# EAGLE design LINX DMX RECIEVER (EAGLE 7.7.0)
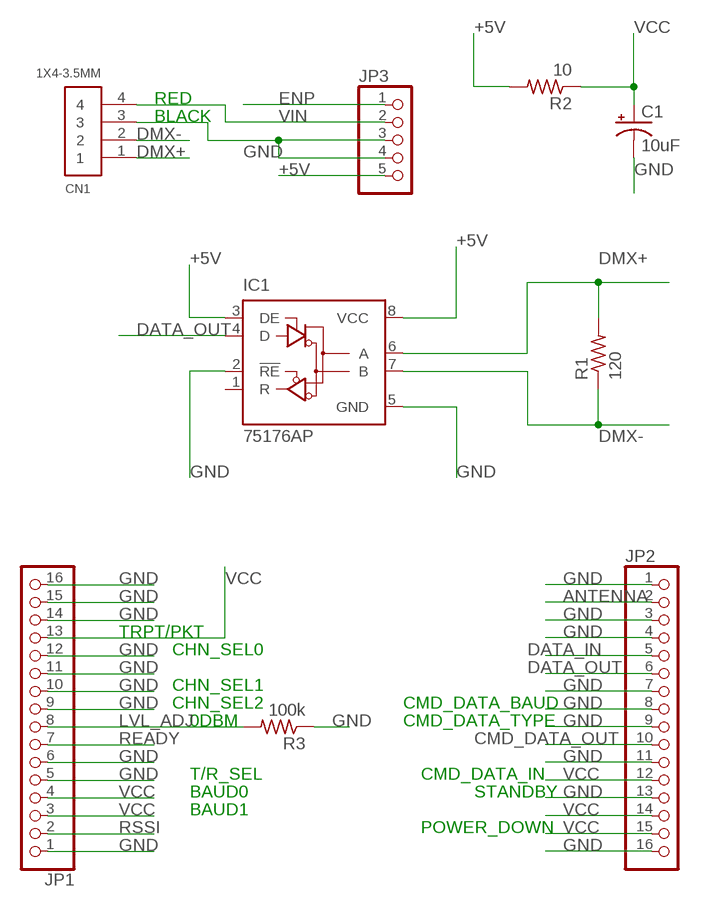
[diagram p0: schematic, sheet 1]

## Parts
C1  10uF  CPOL-USB45181A  [B45181A]
CN1  1X4-3.5MM  [1X04-3.5MM]
IC1  75176AP  [DIL08]
JP1  PINHD-1X16  [1X16]
JP2  PINHD-1X16  [1X16]
JP3  PINHD-1X5/90  [1X05/90]
R1  120  R-US_0414/15  [0414/15]
R2  10  R-US_0414/15  [0414/15]
R3  100k  R-US_0414/15  [0414/15]

## Nets
+5V: IC1.3(DE) IC1.8(VCC) JP3.5 R2.2
ANTENNA: JP2.2
CMD_DATA_OUT: JP2.10
DATA_IN: JP2.5
DATA_OUT: IC1.4(D) JP2.6
DMX+: CN1.1 IC1.6(A) R1.2
DMX-: CN1.2 IC1.7(B) R1.1
ENP: JP3.1
GND: C1.- CN1.3 IC1.2(!RE) IC1.5(GND) JP1.1 JP1.5 JP1.6 JP1.9 JP1.10 JP1.11 JP1.12 JP1.14 JP1.15 JP1.16 JP2.1 JP2.3 JP2.4 JP2.7 JP2.8 JP2.9 JP2.11 JP2.13 JP2.16 JP3.3 JP3.4 R3.1
LVL_ADJ: JP1.8 R3.2
READY: JP1.7
RSSI: JP1.2
VCC: C1.+ JP1.3 JP1.4 JP1.13 JP2.12 JP2.14 JP2.15 R2.1
VIN: CN1.4 JP3.2
Unconnected: IC1.1(R)

## Notes on the sheet
- RED
- BLACK
- TRPT/PKT
- CHN_SEL0
- CHN_SEL1
- CHN_SEL2 | CMD_DATA_BAUD
- 0DBM | CMD_DATA_TYPE
- T/R_SEL | CMD_DATA_IN
- BAUD0 | STANDBY
- BAUD1
- POWER_DOWN

## Library data of the parts
C1 = rcl:CPOL-US: POLARIZED CAPACITOR, American symbol
CN1 = adafruit:1X4: 4-pin connector
IC1 = 751xx:75176A: DIFFERENTIAL BUS TRANSCEIVER Source: http://focus.ti.com/lit/ds/symlink/sn75176a.pdf
JP1 JP2 = pinhead:PINHD-1X16: PIN HEADER
JP3 = pinhead:PINHD-1X5: PIN HEADER
R1-R3 = rcl:R-US_: RESISTOR, American symbol

## Board
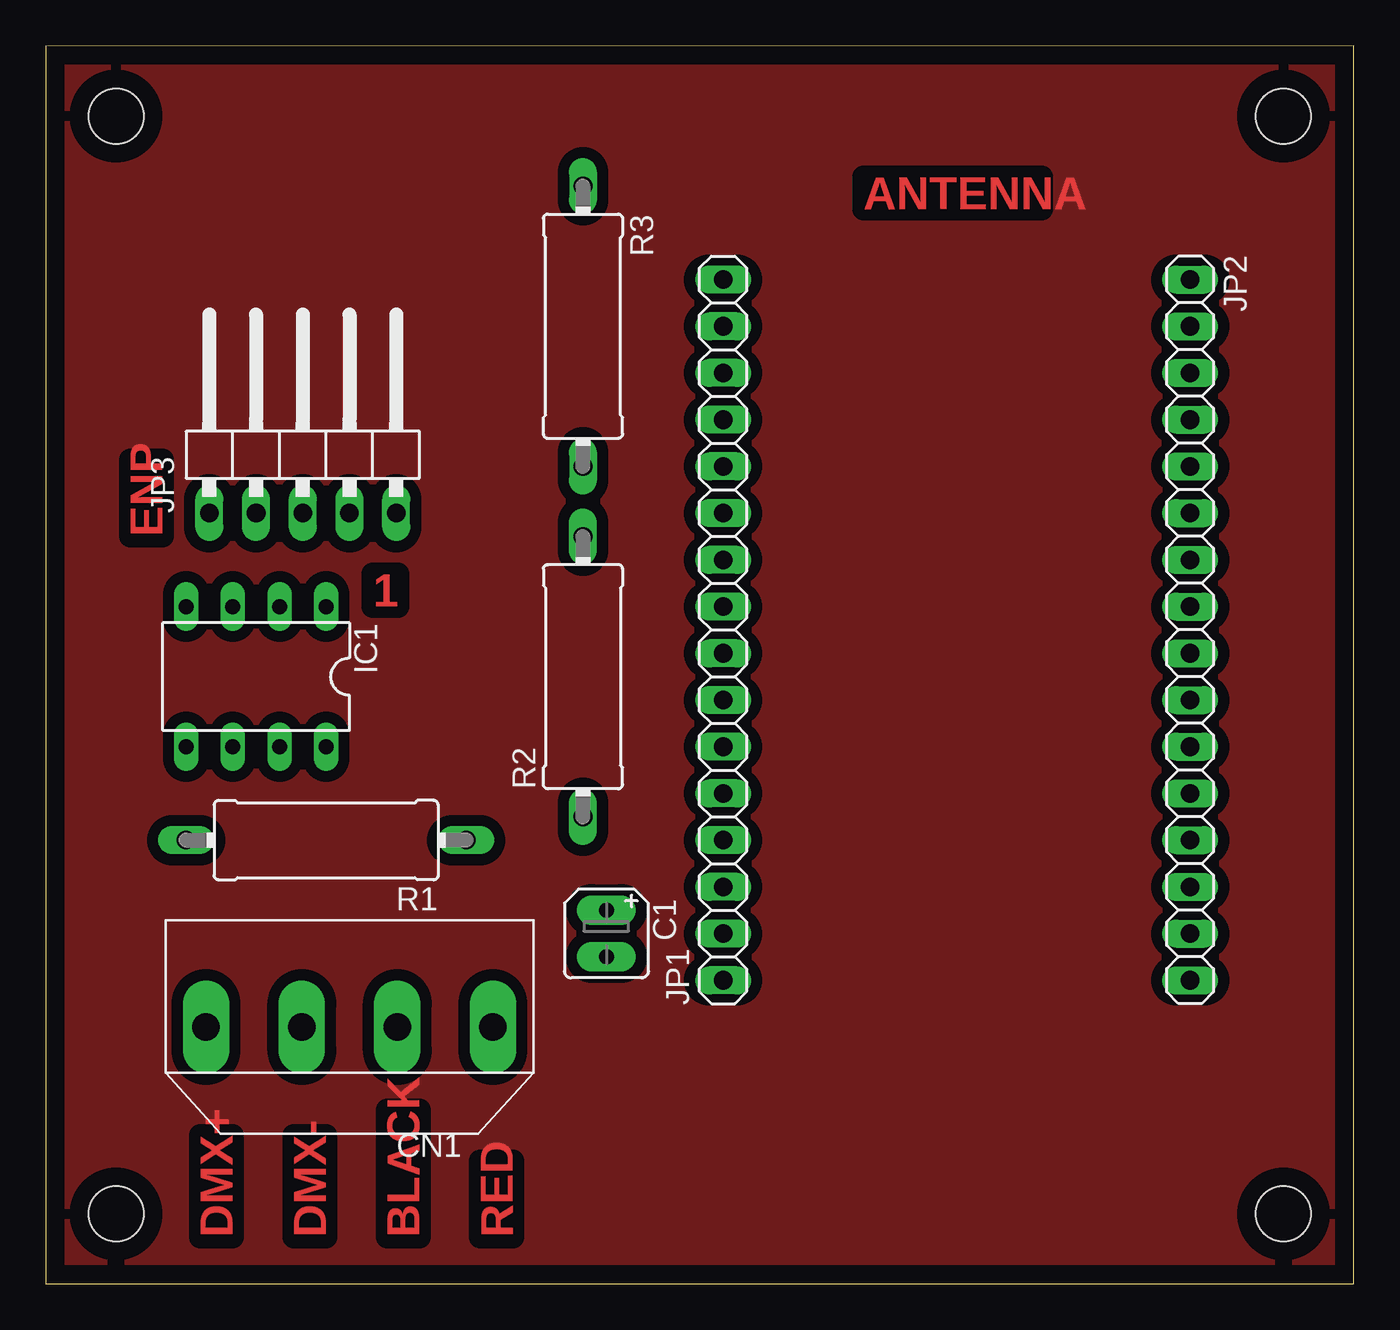
[diagram p1: board, top side]
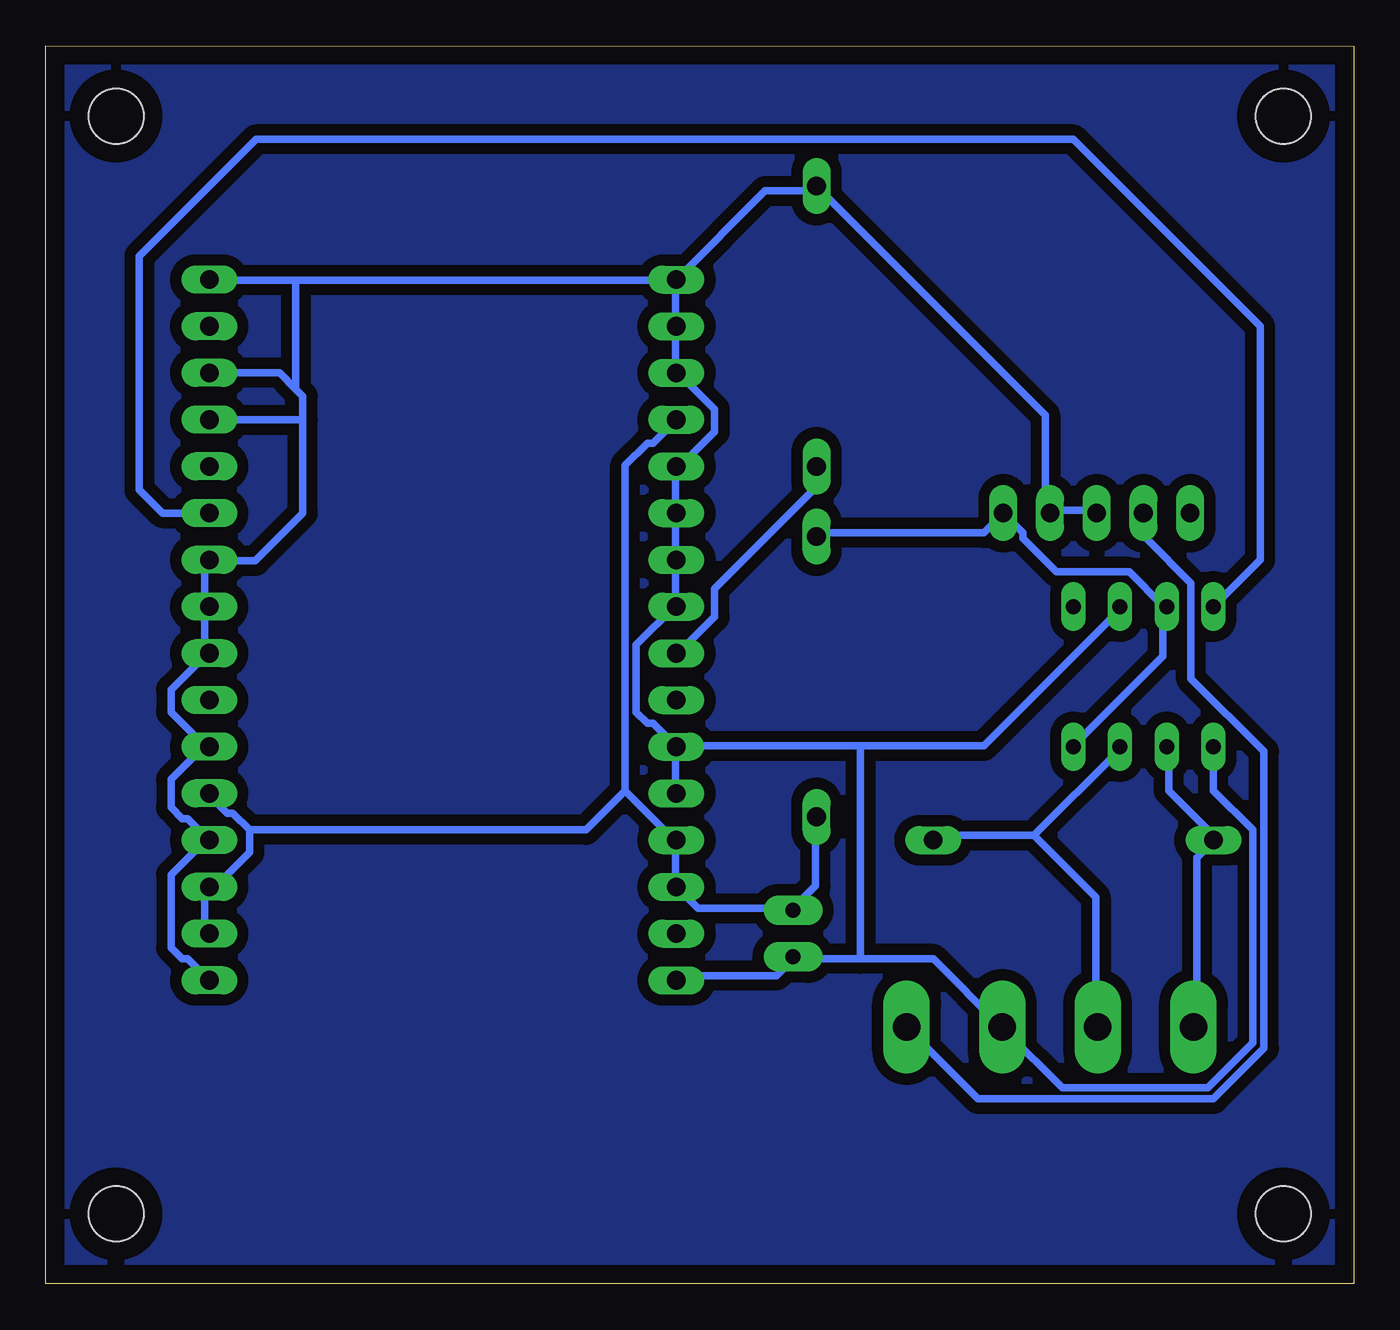
[diagram p2: board, bottom side, seen from below]

Size 71.12 x 67.31 mm. Coordinates in mm from the lower left corner, seen from the top.
Outline: 0,0 71.12,0 71.12,67.31 0,67.3 0,0
Copper layers (1*16): Top 0.035mm / dielectric 1.5mm / Bottom 0.035mm
Design rules "default *": minimum track width 16mil, minimum drill 24mil, track to track 8mil, track to pad 12mil, pad to pad 8mil, via to via 8mil, smd to smd 8mil, copper to edge 40mil, drill to drill 8mil, minimum pad ring 10mil, minimum via ring 8mil, stop-mask expansion 4mil, vias tented up to drill 0mil, thermal gap 10mil
Holes 3 mm at 3.81,3.81 67.31,3.81 67.31,63.5 3.81,63.5

### Footprints (pad centres in the part's own frame; a part is rotated, then mirrored left to right if it is on the bottom)
B45181A = drill 0.813 pad 1.6 long: + -1.27,0; - 1.27,0
1X04-3.5MM = drill 1.5 pad 2.54 long: 1 -7.8,0; 2 -2.6,0; 3 2.6,0; 4 7.8,0
DIL08 = drill 0.813 long: 1 -3.81,-3.81; 2 -1.27,-3.81; 3 1.27,-3.81; 4 3.81,-3.81; 5 3.81,3.81; 6 1.27,3.81; 7 -1.27,3.81; 8 -3.81,3.81
1X16 = drill 1.016 long: 1 -19.05,0; 2 -16.51,0; 3 -13.97,0; 4 -11.43,0; 5 -8.89,0; 6 -6.35,0; 7 -3.81,0; 8 -1.27,0; 9 1.27,0; 10 3.81,0; 11 6.35,0; 12 8.89,0; 13 11.43,0; 14 13.97,0; 15 16.51,0; 16 19.05,0
1X05/90 = drill 1.016 long: 1 -5.08,-3.81; 2 -2.54,-3.81; 3 0,-3.81; 4 2.54,-3.81; 5 5.08,-3.81
0414/15 = drill 1.016 long: 1 -7.62,0; 2 7.62,0

### Placement (x,y rotation side)
C1  30.48,19.05 270 top
CN1  16.51,13.97 0 top
IC1  11.43,33.02 180 top
JP1  36.83,35.56 90 top
JP2  62.23,35.56 270 top
JP3  13.97,45.72 0 top
R1  15.24,24.13 180 top
R2  29.21,33.02 90 top
R3  29.21,52.07 270 top

### Tracks (layer width: path | path; a pad name or v marks a point on that pad's centre or on a via)
+5V
  Bottom 0.406: R2.2 28.96,40.84 20.12,40.84 JP3.5 17.98,40.84 17.98,40.54 16.15,38.71 12.19,38.71 10.36,36.88 IC1.3 10.36,36.58 10.36,34.14 15.24,29.26 IC1.8
DATA_OUT
  Bottom 0.406: IC1.4 5.08,39.37 5.08,52.07 15.24,62.23 59.69,62.23 66.04,55.88 66.04,43.18 64.77,41.91 JP2.6
DMX+
  Bottom 0.406: IC1.6 10.06,28.96 10.06,26.82 7.62,24.38 R1.2 7.62,24.08 8.53,23.16 8.53,14.02 CN1.1
DMX-
  Bottom 0.406: 17.37,24.38 12.8,28.96 IC1.7 | 17.37,24.38 22.86,24.38 R1.1 | 17.37,24.38 14.02,21.03 14.02,14.02 CN1.2
GND
  Bottom 0.406: 30.48,17.68 31.39,16.76 36.58,16.76 JP1.1 | IC1.5 7.62,26.82 5.49,24.69 5.49,13.11 7.92,10.67 15.85,10.67 18.9,13.72 CN1.3 19.2,14.02 22.86,17.68 26.82,17.68 | 26.82,17.68 30.48,17.68 | 30.48,17.68 C1.- | 62.48,54.56 JP2.1 62.18,54.56 57.53,54.56 | JP2.16 63.4,17.68 63.7,17.68 64.31,18.29 64.31,22.25 62.48,24.08 JP2.13 63.4,25.3 63.7,25.3 64.31,25.91 64.31,27.43 62.48,29.26 | 62.48,29.26 64.31,31.09 64.31,32.31 62.48,34.14 JP2.9 62.48,34.44 62.48,36.58 JP2.8 62.48,36.88 62.48,39.32 | 62.48,29.26 JP2.11 | 62.48,39.32 JP2.7 | 26.82,29.26 36.58,29.26 JP1.6 | 26.82,29.26 20.12,29.26 12.8,36.58 IC1.2 | JP1.5 36.88,26.82 36.88,28.96 JP1.6 | 36.88,36.88 36.88,39.32 JP1.10 36.88,39.62 36.88,41.76 JP1.11 36.88,42.06 36.88,44.2 JP1.12 36.58,44.5 34.75,46.33 34.75,47.55 36.58,49.38 JP1.14 36.88,49.68 36.88,51.82 JP1.15 36.88,52.12 36.88,54.56 | JP3.3 14.02,42.06 16.46,42.06 JP3.4 16.76,42.06 16.76,47.24 R3.1 29.26,59.44 32,59.44 JP1.16 36.88,54.56 | JP1.6 38.1,30.48 38.41,30.48 39.01,31.09 39.01,34.75 36.88,36.88 | 36.88,36.88 JP1.9 | 36.88,54.56 57.53,54.56 | 26.82,29.26 26.82,17.68 | 62.48,39.32 59.74,39.32 57.15,41.91 57.15,46.99 | 57.15,46.99 57.15,48.26 57.53,48.64 | 57.53,48.64 58.42,49.53 JP2.3 | JP2.4 57.15,46.99 | 57.53,54.56 57.53,48.64
LVL_ADJ
  Bottom 0.406: R3.2 29.26,44.2 29.26,43.28 34.75,37.8 34.75,36.27 36.58,34.44 JP1.8
N$1
  pour Top (isolate 0.61): 0,67.31 71.12,67.31 71.12,0 0,0
N$2
  pour Bottom (isolate 0.61): 0,67.31 71.12,67.31 71.12,0 0,0
VCC
  Bottom 0.406: JP2.15 62.48,19.2 62.48,21.34 JP2.14 62.18,21.34 60.05,23.47 60.05,24.69 | 60.05,24.69 60.96,25.6 61.27,25.6 62.18,26.52 JP2.12 | 30.48,20.42 29.26,21.64 29.26,25.3 R2.1 | 36.88,24.08 36.88,21.64 JP1.3 35.66,20.42 30.48,20.42 | JP1.13 38.1,45.72 38.41,45.72 39.62,44.5 39.62,26.82 | 36.88,24.08 39.62,26.82 | 36.88,24.08 JP1.4 | 30.48,20.42 C1.+ | 60.05,24.69 41.76,24.69 39.62,26.82
VIN
  Bottom 0.406: JP3.2 11.28,41.76 11.28,40.54 8.84,38.1 8.84,32.92 4.88,28.96 4.88,12.8 7.62,10.06 20.42,10.06 24.08,13.72 CN1.4

### Text on the board
Top: ANTENNA | ENP | 1 | DMX+ | DMX- | BLACK | RED